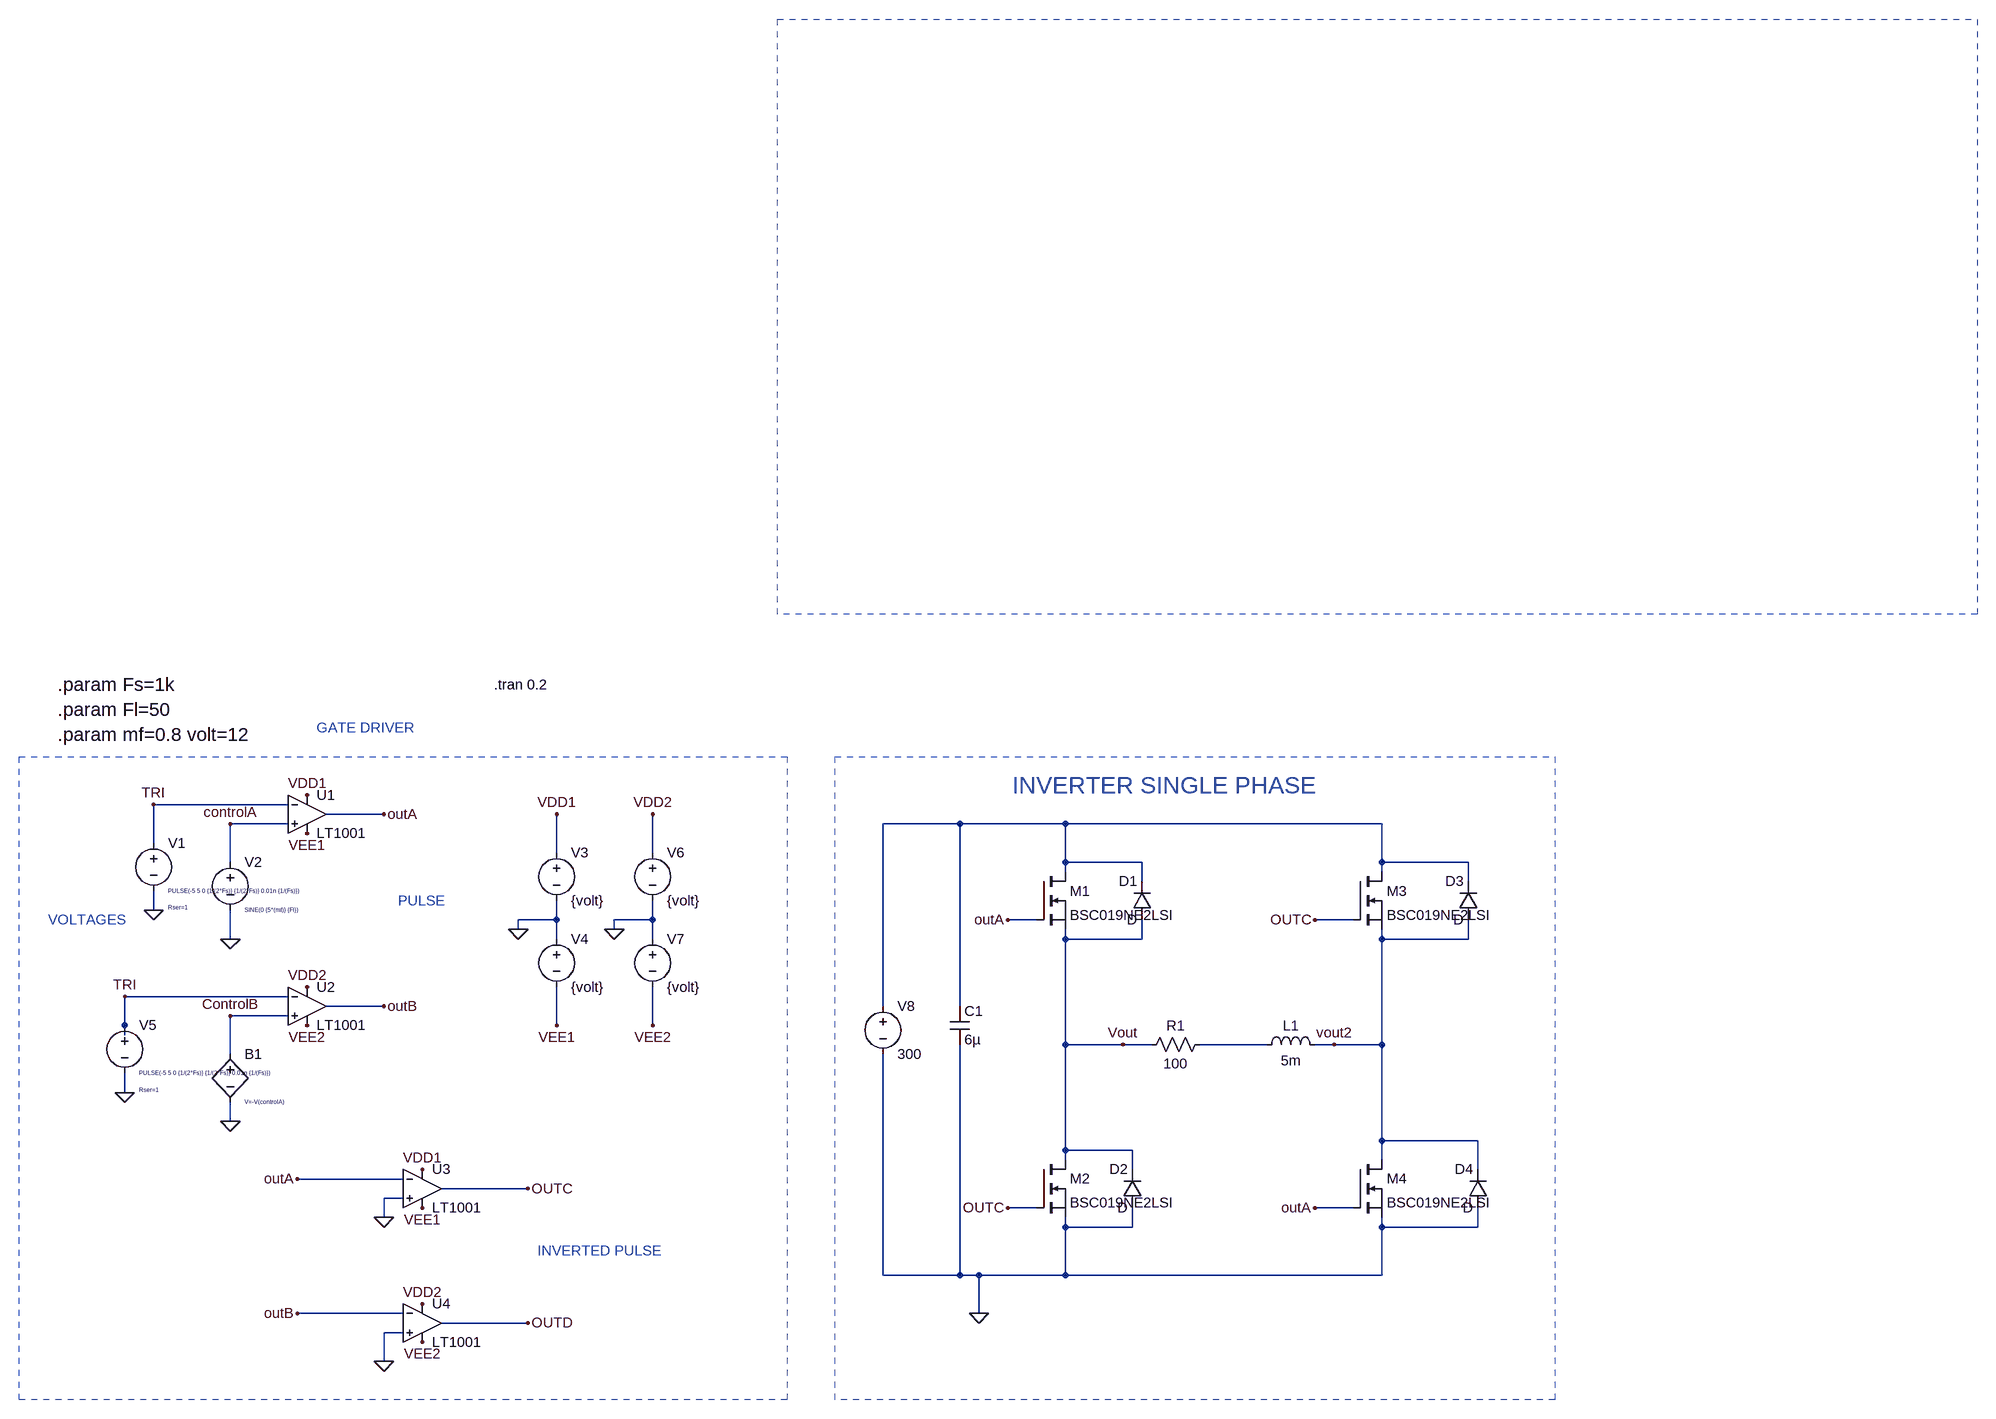
[diagram p0: schematic INVERTER WITH GATE DRIVER CIRCUIT.asc]
INVERTER WITH GATE DRIVER CIRCUIT.asc, the LTspice schematic file:
Version 4
SHEET 1 2372 2824
WIRE -448 1824 -672 1824
WIRE -288 1840 -384 1840
WIRE -448 1856 -544 1856
WIRE 672 1856 544 1856
WIRE 848 1856 672 1856
WIRE 1376 1856 848 1856
WIRE -672 1888 -672 1824
WIRE 0 1904 0 1840
WIRE 160 1904 160 1840
WIRE -544 1920 -544 1856
WIRE 848 1920 848 1856
WIRE 976 1920 848 1920
WIRE 1376 1920 1376 1856
WIRE 1520 1920 1376 1920
WIRE 848 1936 848 1920
WIRE 1376 1936 1376 1920
WIRE 976 1952 976 1920
WIRE 1520 1952 1520 1920
WIRE -672 2000 -672 1968
WIRE 0 2016 0 1984
WIRE 0 2016 -64 2016
WIRE 160 2016 160 1984
WIRE 160 2016 96 2016
WIRE 800 2016 752 2016
WIRE 1328 2016 1264 2016
WIRE -64 2032 -64 2016
WIRE 96 2032 96 2016
WIRE -544 2048 -544 2000
WIRE 0 2048 0 2016
WIRE 160 2048 160 2016
WIRE 848 2048 848 2032
WIRE 976 2048 976 2016
WIRE 976 2048 848 2048
WIRE 1376 2048 1376 2032
WIRE 1520 2048 1520 2016
WIRE 1520 2048 1376 2048
WIRE -448 2144 -720 2144
WIRE -288 2160 -384 2160
WIRE 544 2160 544 1856
WIRE 672 2160 672 1856
WIRE -448 2176 -544 2176
WIRE -720 2192 -720 2144
WIRE 0 2192 0 2128
WIRE 160 2192 160 2128
WIRE -720 2208 -720 2192
WIRE 848 2224 848 2048
WIRE 944 2224 848 2224
WIRE 992 2224 944 2224
WIRE 1184 2224 1072 2224
WIRE 1296 2224 1264 2224
WIRE 1376 2224 1376 2048
WIRE 1376 2224 1296 2224
WIRE -544 2240 -544 2176
WIRE -720 2304 -720 2272
WIRE -544 2352 -544 2320
WIRE 1376 2384 1376 2224
WIRE 1536 2384 1376 2384
WIRE 848 2400 848 2224
WIRE 960 2400 848 2400
WIRE 848 2416 848 2400
WIRE 1376 2416 1376 2384
WIRE 960 2432 960 2400
WIRE 1536 2432 1536 2384
WIRE -256 2448 -432 2448
WIRE -48 2464 -192 2464
WIRE -256 2480 -288 2480
WIRE 800 2496 752 2496
WIRE 1328 2496 1264 2496
WIRE -288 2512 -288 2480
WIRE 848 2528 848 2512
WIRE 960 2528 960 2496
WIRE 960 2528 848 2528
WIRE 1376 2528 1376 2512
WIRE 1536 2528 1536 2496
WIRE 1536 2528 1376 2528
WIRE 544 2608 544 2240
WIRE 672 2608 672 2224
WIRE 672 2608 544 2608
WIRE 704 2608 672 2608
WIRE 848 2608 848 2528
WIRE 848 2608 704 2608
WIRE 1376 2608 1376 2528
WIRE 1376 2608 848 2608
WIRE -256 2672 -432 2672
WIRE 704 2672 704 2608
WIRE -48 2688 -192 2688
WIRE -256 2704 -288 2704
WIRE -288 2752 -288 2704
FLAG -672 2000 0
FLAG -672 1824 TRI
FLAG -544 2048 0
FLAG -544 1856 controlA
FLAG -544 2352 0
FLAG -544 2176 ControlB
FLAG 0 1840 VDD1
FLAG -416 1808 VDD1
FLAG -416 2128 VDD2
FLAG -64 2032 0
FLAG 0 2192 VEE1
FLAG -416 2192 VEE2
FLAG -416 1872 VEE1
FLAG -288 1840 outA
FLAG -288 2160 outB
FLAG -720 2304 0
FLAG -720 2144 TRI
FLAG 160 1840 VDD2
FLAG 96 2032 0
FLAG 160 2192 VEE2
FLAG 752 2016 outA
FLAG -288 2512 0
FLAG -288 2752 0
FLAG -432 2448 outA
FLAG -432 2672 outB
FLAG -48 2464 OUTC
FLAG -48 2688 OUTD
FLAG -224 2432 VDD1
FLAG -224 2656 VDD2
FLAG -224 2720 VEE2
FLAG -224 2496 VEE1
FLAG 944 2224 Vout
FLAG 1296 2224 vout2
FLAG 704 2672 0
FLAG 1264 2496 outA
FLAG 1264 2016 OUTC
FLAG 752 2496 OUTC
SYMBOL voltage -672 1872 R0
WINDOW 3 24 96 Left 0
WINDOW 123 0 0 Left 0
WINDOW 39 24 124 Left 0
SYMATTR Value PULSE(-5 5 0 {1/(2*Fs)} {1/(2*Fs)} 0.01n {1/(Fs)})
SYMATTR SpiceLine Rser=1
SYMATTR InstName V1
SYMBOL voltage -544 1904 R0
WINDOW 3 24 96 Left 0
WINDOW 123 0 0 Left 0
WINDOW 39 0 0 Left 0
SYMATTR Value SINE(0 {5*(mf)} {Fl})
SYMATTR InstName V2
SYMBOL bv -544 2224 R0
WINDOW 3 24 96 Left 0
SYMATTR Value V=-V(controlA)
SYMATTR InstName B1
SYMBOL OpAmps\\LT1001 -416 1776 R0
SYMATTR InstName U1
SYMBOL OpAmps\\LT1001 -416 2096 R0
SYMATTR InstName U2
SYMBOL voltage 0 1888 R0
WINDOW 123 0 0 Left 0
WINDOW 39 0 0 Left 0
SYMATTR InstName V3
SYMATTR Value {volt}
SYMBOL voltage 0 2032 R0
WINDOW 123 0 0 Left 0
WINDOW 39 0 0 Left 0
SYMATTR InstName V4
SYMATTR Value {volt}
SYMBOL voltage -720 2176 R0
WINDOW 3 24 96 Left 0
WINDOW 123 0 0 Left 0
WINDOW 39 24 124 Left 0
SYMATTR Value PULSE(-5 5 0 {1/(2*Fs)} {1/(2*Fs)} 0.01n {1/(Fs)})
SYMATTR SpiceLine Rser=1
SYMATTR InstName V5
SYMBOL voltage 160 1888 R0
WINDOW 123 0 0 Left 0
WINDOW 39 0 0 Left 0
SYMATTR InstName V6
SYMATTR Value {volt}
SYMBOL voltage 160 2032 R0
WINDOW 123 0 0 Left 0
WINDOW 39 0 0 Left 0
SYMATTR InstName V7
SYMATTR Value {volt}
SYMBOL nmos 800 1936 R0
SYMATTR InstName M1
SYMATTR Value BSC019NE2LSI
SYMBOL res 1088 2208 R90
WINDOW 0 0 56 VBottom 2
WINDOW 3 32 56 VTop 2
SYMATTR InstName R1
SYMATTR Value 100
SYMBOL ind 1168 2240 R270
WINDOW 0 32 56 VTop 2
WINDOW 3 5 56 VBottom 2
SYMATTR InstName L1
SYMATTR Value 5m
SYMBOL voltage 544 2144 R0
WINDOW 123 0 0 Left 0
WINDOW 39 0 0 Left 0
SYMATTR InstName V8
SYMATTR Value 300
SYMBOL cap 656 2160 R0
SYMATTR InstName C1
SYMATTR Value 6µ
SYMATTR SpiceLine Rser=1
SYMBOL diode 992 2016 R180
WINDOW 0 24 64 Left 2
WINDOW 3 24 0 Left 2
SYMATTR InstName D1
SYMBOL diode 976 2496 R180
WINDOW 0 24 64 Left 2
WINDOW 3 24 0 Left 2
SYMATTR InstName D2
SYMBOL diode 1536 2016 R180
WINDOW 0 24 64 Left 2
WINDOW 3 24 0 Left 2
SYMATTR InstName D3
SYMBOL diode 1552 2496 R180
WINDOW 0 24 64 Left 2
WINDOW 3 24 0 Left 2
SYMATTR InstName D4
SYMBOL OpAmps\\LT1001 -224 2400 R0
SYMATTR InstName U3
SYMBOL OpAmps\\LT1001 -224 2624 R0
SYMATTR InstName U4
SYMBOL nmos 800 2416 R0
SYMATTR InstName M2
SYMATTR Value BSC019NE2LSI
SYMBOL nmos 1328 1936 R0
SYMATTR InstName M3
SYMATTR Value BSC019NE2LSI
SYMBOL nmos 1328 2416 R0
SYMATTR InstName M4
SYMATTR Value BSC019NE2LSI
TEXT -832 1624 Left 3 !.param Fs=1k\n.param Fl=50\n.param mf=0.8 volt=12
TEXT -104 1624 Left 2 !.tran 0.2
TEXT -400 1696 Left 2 ;GATE DRIVER
TEXT -848 2016 Left 2 ;VOLTAGES
TEXT -32 2568 Left 2 ;INVERTED PULSE
TEXT -264 1984 Left 2 ;PULSE
TEXT 760 1792 Left 4 ;INVERTER SINGLE PHASE
RECTANGLE Normal 2368 352 368 -640 2
RECTANGLE Normal 384 2816 -896 1744 2
RECTANGLE Normal 1664 2816 464 1744 2

The netlist it stands for:
* INVERTER WITH GATE DRIVER CIRCUIT.asc
V1 TRI 0 PULSE(-5 5 0 {1/(2*Fs)} {1/(2*Fs)} 0.01n {1/(Fs)}) Rser=1
V2 controlA 0 SINE(0 {5*(mf)} {Fl})
B1 ControlB 0 V=-V(controlA)
XU1 controlA TRI VDD1 VEE1 outA LT1001  ; pins In+ In- V+ V- OUT
XU2 ControlB TRI VDD2 VEE2 outB LT1001  ; pins In+ In- V+ V- OUT
V3 VDD1 0 {volt}
V4 0 VEE1 {volt}
V5 TRI 0 PULSE(-5 5 0 {1/(2*Fs)} {1/(2*Fs)} 0.01n {1/(Fs)}) Rser=1
V6 VDD2 0 {volt}
V7 0 VEE2 {volt}
M1 N001 outA Vout Vout BSC019NE2LSI
R1 N002 Vout 100
L1 N002 vout2 5m
V8 N001 0 300
C1 N001 0 6µ Rser=1
D1 Vout N001 D
D2 0 Vout D
D3 vout2 N001 D
D4 0 vout2 D
XU3 0 outA VDD1 VEE1 OUTC LT1001  ; pins In+ In- V+ V- OUT
XU4 0 outB VDD2 VEE2 OUTD LT1001  ; pins In+ In- V+ V- OUT
M2 Vout OUTC 0 0 BSC019NE2LSI
M3 N001 OUTC vout2 vout2 BSC019NE2LSI
M4 vout2 outA 0 0 BSC019NE2LSI
.model D D
.lib standard.dio
.model NMOS NMOS
.model PMOS PMOS
.lib standard.mos
.param Fs=1k
.param Fl=50
.param mf=0.8 volt=12
.tran 0.2
* GATE DRIVER
* VOLTAGES
* INVERTED PULSE
* PULSE
* INVERTER SINGLE PHASE
.lib LTC.lib
.backanno
.end